# Altium project PMI_Action.PrjPcb
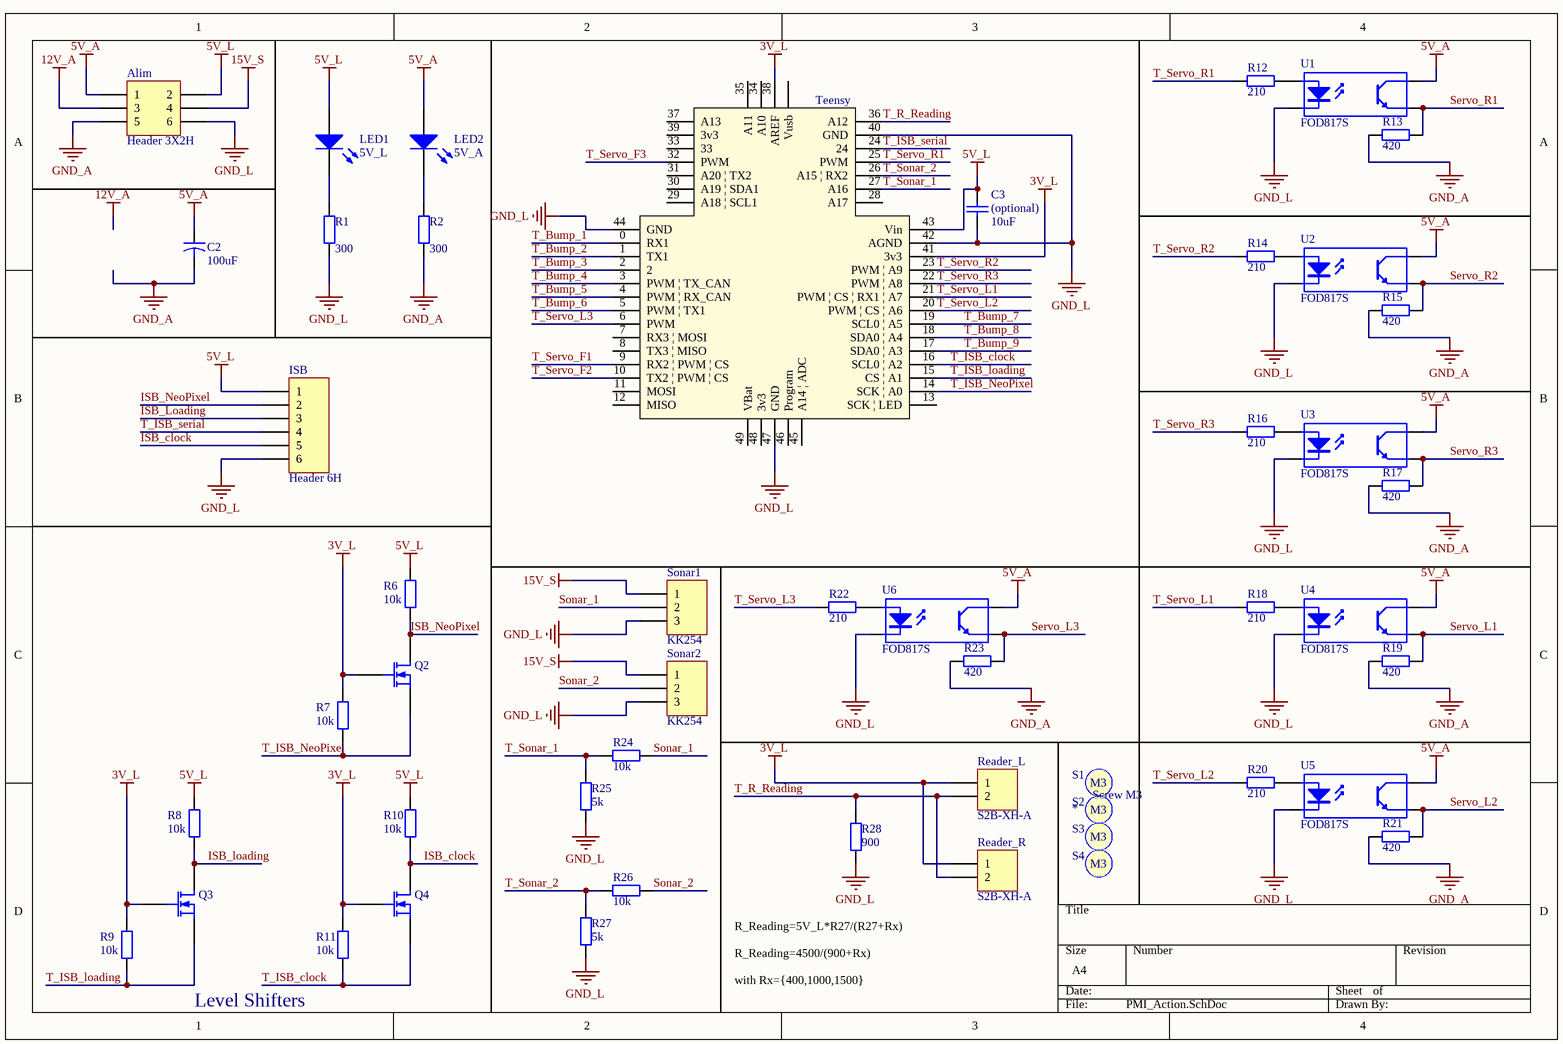
[diagram p0: PMI_Action.SchDoc]
2 sheets, 82 parts. Net scope: global (net labels, ports and power ports of the same name join across sheets).
Board files: PMI_Action.PcbDoc, PMI_ActionV2.PcbDoc
Sheets:
  PMI_Action.SchDoc
  PMI_Action_bumpers.SchDoc

## Sheet PMI_Action.SchDoc
size A4

### Parts
Alim  Header 3X2H  [MOLEX_MINIFITJR_3X2]
C2  value 100uF  [Capacitor]  (hidden comment: Cap2)
C3  (optional)  value 10uF  [Capacitor 1206]
ISB  Header 6H  [S6B-XH-A]
LED1  5V_L  [KP-3216SEC]
LED2  5V_A  [KP-3216SEC]
Q2  MOSFET-N  [SOT23_M]  (value not drawn)
Q3  MOSFET-N  [SOT23_M]  (value not drawn)
Q4  MOSFET-N  [SOT23_M]  (value not drawn)
R1  value 300  [Resistor 1206]  (hidden comment: Res2)
R2  value 300  [Resistor 1206]  (hidden comment: Res2)
R6  value 10k  [Resistor 1206]  (hidden comment: Res2)
R7  value 10k  [Resistor 1206]  (hidden comment: Res2)
R8  value 10k  [Resistor 1206]  (hidden comment: Res2)
R9  value 10k  [Resistor 1206]  (hidden comment: Res2)
R10  value 10k  [Resistor 1206]  (hidden comment: Res2)
R11  value 10k  [Resistor 1206]  (hidden comment: Res2)
R12  value 210  [Resistor 1206]  (hidden comment: Res2)
R13  value 420  [Resistor 1206]  (hidden comment: Res2)
R14  value 210  [Resistor 1206]  (hidden comment: Res2)
R15  value 420  [Resistor 1206]  (hidden comment: Res2)
R16  value 210  [Resistor 1206]  (hidden comment: Res2)
R17  value 420  [Resistor 1206]  (hidden comment: Res2)
R18  value 210  [Resistor 1206]  (hidden comment: Res2)
R19  value 420  [Resistor 1206]  (hidden comment: Res2)
R20  value 210  [Resistor 1206]  (hidden comment: Res2)
R21  value 420  [Resistor 1206]  (hidden comment: Res2)
R22  value 210  [Resistor 1206]  (hidden comment: Res2)
R23  value 420  [Resistor 1206]  (hidden comment: Res2)
R24  value 10k  [Resistor 1206]  (hidden comment: Res2)
R25  value 5k  [Resistor 1206]  (hidden comment: Res2)
R26  value 10k  [Resistor 1206]  (hidden comment: Res2)
R27  value 5k  [Resistor 1206]  (hidden comment: Res2)
R28  value 900  [Resistor 1206]  (hidden comment: Res2)
Reader_L  S2B-XH-A  [S2B-XH-A]
Reader_R  S2B-XH-A  [S2B-XH-A]
S1  Screw M3  [Screw M3]  (mechanical)
S2  Screw M3  [Screw M3]  (value not drawn)  (mechanical)
S3  Screw M3  [Screw M3]  (value not drawn)  (mechanical)
S4  Screw M3  [Screw M3]  (value not drawn)  (mechanical)
Sonar1  KK254  [MOLEX KK254 3X1H M]
Sonar2  KK254  [MOLEX KK254 3X1H M]
Teensy  Teensy 3.2  [Teensy_A_PMI]  (value not drawn)
U1  FOD817S  [SOP254P1016X385-4N]
U2  FOD817S  [SOP254P1016X385-4N]
U3  FOD817S  [SOP254P1016X385-4N]
U4  FOD817S  [SOP254P1016X385-4N]
U5  FOD817S  [SOP254P1016X385-4N]
U6  FOD817S  [SOP254P1016X385-4N]

### Nets
3V_L: Q2.2(G) Q3.2(G) Q4.2(G) R7.2 R9.2 R11.2 Reader_L.1 Reader_R.1 Teensy.38(AREF) Teensy.41(3v3)
5V_A: Alim.1 C2.1 LED2.1(A) U1.4(C) U2.4(C) U3.4(C) U4.4(C) U5.4(C) U6.4(C)
5V_L: Alim.2 C3.2 ISB.1 LED1.1(A) R6.2 R8.2 R10.2 Teensy.43(Vin)
12V_A: Alim.3
15V_S: Alim.4 Sonar1.1 Sonar2.1
GND_A: Alim.5 C2.2 R2.1 R13.2 R15.2 R17.2 R19.2 R21.2 R23.2
GND_L: Alim.6 C3.1 ISB.6 R1.1 R25.2 R27.2 R28.2 Sonar1.3 Sonar2.3 Teensy.40(GND) Teensy.42(AGND) Teensy.44(GND) Teensy.47(GND) U1.2(K) U2.2(K) U3.2(K) U4.2(K) U5.2(K) U6.2(K)
ISB_clock: ISB.5 Q4.1(D) R10.1
ISB_Loading: ISB.3 Q3.1(D) R8.1
ISB_NeoPixel: ISB.2 Q2.1(D) R6.1
Servo_L1: R19.1 U4.3(E)
Servo_L2: R21.1 U5.3(E)
Servo_L3: R23.1 U6.3(E)
Servo_R1: R13.1 U1.3(E)
Servo_R2: R15.1 U2.3(E)
Servo_R3: R17.1 U3.3(E)
Sonar_1: R24.1 Sonar1.2
Sonar_2: R26.1 Sonar2.2
T_Bump_1: Teensy.0(RX1)  [project net Bump_1]
T_Bump_2: Teensy.1(TX1)  [project net Bump_2]
T_Bump_3: Teensy.2  [project net Bump_3]
T_Bump_4: Teensy.3(PWM_|_TX_CAN)  [project net Bump_4]
T_Bump_5: Teensy.4(PWM_|_RX_CAN)  [project net Bump_5]
T_Bump_6: Teensy.5(PWM_|_TX1)  [project net Bump_6]
T_Bump_7: Teensy.19(SCL0_|_A5)  [project net Bump_7]
T_Bump_8: Teensy.18(SDA0_|_A4)  [project net Bump_8]
T_Bump_9: Teensy.17(SDA0_|_A3)  [project net Bump_9]
T_ISB_clock: Q4.3(S) R11.1 Teensy.16(SCL0_|_A2)
T_ISB_loading: Q3.3(S) R9.1 Teensy.15(CS_|_A1)
T_ISB_NeoPixel: Q2.3(S) R7.1 Teensy.14(SCK_|_A0)
T_ISB_serial: ISB.4 Teensy.24
T_R_Reading: R28.1 Reader_L.2 Reader_R.2 Teensy.36(A12)
T_Servo_F1: Teensy.9(RX2_|_PWM_|_CS)
T_Servo_F2: Teensy.10(TX2_|_PWM_|_CS)
T_Servo_F3: Teensy.32(PWM)
T_Servo_L1: R18.2 Teensy.21(PWM_|_CS_|_RX1_|_A7)
T_Servo_L2: R20.2 Teensy.20(PWM_|_CS_|_A6)
T_Servo_L3: R22.2 Teensy.6(PWM)
T_Servo_R1: R12.2 Teensy.25(PWM)
T_Servo_R2: R14.2 Teensy.23(PWM_|_A9)
T_Servo_R3: R16.2 Teensy.22(PWM_|_A8)
T_Sonar_1: R24.2 R25.1 Teensy.27(A16)
T_Sonar_2: R26.2 R27.1 Teensy.26(A15_|_RX2)
NetLED1_2: LED1.2(K) R1.2
NetLED2_2: LED2.2(K) R2.2
NetR12_1: R12.1 U1.1(A)
NetR14_1: R14.1 U2.1(A)
NetR16_1: R16.1 U3.1(A)
NetR18_1: R18.1 U4.1(A)
NetR20_1: R20.1 U5.1(A)
NetR22_1: R22.1 U6.1(A)

Not connected (* = marked no-connect by the designer): Teensy 7(RX3_|_MOSI) 8(TX3_|_MISO) 11(MOSI) 12(MISO) 13(SCK_|_LED) 28(A17) 29(A18_|_SCL1) 30(A19_|_SDA1) 31(A20_|_TX2) 33 34(A10) 35(A11) 37(A13) 39(3v3) 45(A14_|_ADC) 46(Program) 48(3v3) 49(VBat) 50(Vusb)

### Notes on the sheet
- (near Reader_R) R_Reading=5V_L*R27/(R27+Rx)
  R_Reading=4500/(900+Rx)
  with Rx={400,1000,1500}
- (near R11) Level Shifters
- (in symbol Screw M3) M3

### Library data of the parts
Alim = Header 3X2H: Header, 3-Pin, Dual row, Right Angle; LatestRevisionDate: 17-Jul-2002; LatestRevisionNote: Re-released for DXP Platform.; Publisher: Altium Limited
C2 = Cap2: Capacitor; Published: 23-Sep-2002; PackageReference: CAPR5-4X5; Publisher: Altium Limited; PackageDescription: Capacitor; 2 Leads
C3 = Cap: Capacitor; Published: 8-Jun-2000; LatestRevisionDate: 17-Jul-2002; LatestRevisionNote: Re-released for DXP Platform.; PackageReference: RAD-0.3; Publisher: Altium Limited; PackageDescription: Radial Cap, Thru-Hole; 2 Leads; 0.3 in Pin Spacing
ISB = Header 6H: Header, 6-Pin, Right Angle; LatestRevisionDate: 17-Jul-2002; LatestRevisionNote: Re-released for DXP Platform.; Publisher: Altium Limited
LED1 LED2 = LED2: Typical RED, GREEN, YELLOW, AMBER GaAs LED; Published: 8-Jun-2000; LatestRevisionDate: 17-Jul-2002; LatestRevisionNote: Re-released for DXP Platform.; PackageVersion: Feb-2002; PackageReference: 3.2X1.6X1.1; Publisher: Altium Limited; PackageDescription: SM LED; 2 Flat Leads
Q2-Q4 = MOSFET-N: N-Channel MOSFET; Published: 8-Jun-2000; LatestRevisionDate: 17-Jul-2002; LatestRevisionNote: Re-released for DXP Platform.; PackageVersion: 1995/1996; PackageReference: E3; Publisher: Altium Limited; PackageDescription: TO, Flat Index; 3 In-Line, Axial Leads; Body Dia. 4.6mm; Lead Dia. 0.5 mm (max)
R1 R2 R6-R28 = Res2: Resistor; Published: 8-Jun-2000; LatestRevisionDate: 17-Jul-2002; LatestRevisionNote: Re-released for DXP Platform.; PackageReference: AXIAL-0.4; Publisher: Altium Limited; PackageDescription: Axial Device, Thru-Hole; 2 Leads; 0.4 in Pin Spacing
Reader_L Reader_R = Header 2H: Header, 2-Pin, Right Angle; LatestRevisionDate: 17-Jul-2002; LatestRevisionNote: Re-released for DXP Platform.; Publisher: Altium Limited
Sonar1 Sonar2 = Header 3H: Header, 3-Pin, Right Angle; LatestRevisionDate: 17-Jul-2002; LatestRevisionNote: Re-released for DXP Platform.; Publisher: Altium Limited
Teensy = teensy3.2
U1-U6 = Optoisolator1: 4-Pin Phototransistor Optocoupler; Published: 24-Mar-1999; LatestRevisionDate: 04-Mar-2005; LatestRevisionNote: Sch pins 3 & 4 Swapped.; DatasheetVersion: Nov-2003; PackageReference: DIP-4; Publisher: Altium Limited

## Sheet PMI_Action_bumpers.SchDoc
size A4
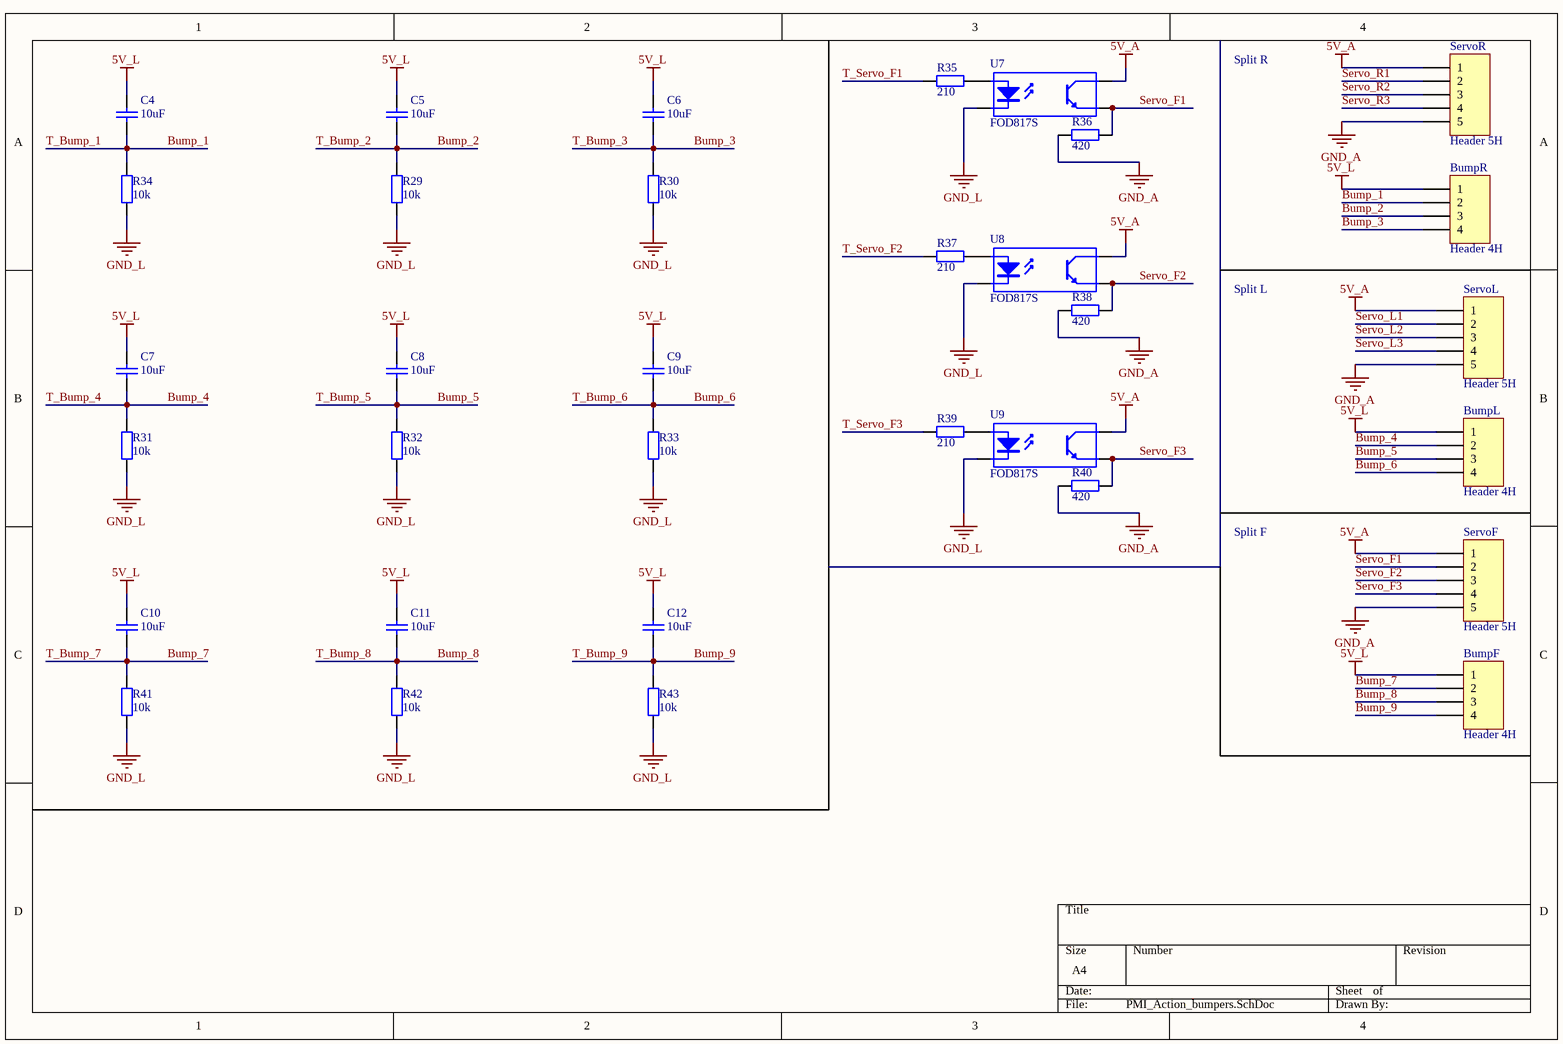
[diagram p1: PMI_Action_bumpers.SchDoc]

### Parts
BumpF  Header 4H  [S4B-XH-A]
BumpL  Header 4H  [S4B-XH-A]
BumpR  Header 4H  [S4B-XH-A]
C4  value 10uF  [Capacitor 1206]  (hidden comment: (optional))
C5  value 10uF  [Capacitor 1206]  (hidden comment: (optional))
C6  value 10uF  [Capacitor 1206]  (hidden comment: (optional))
C7  value 10uF  [Capacitor 1206]  (hidden comment: (optional))
C8  value 10uF  [Capacitor 1206]  (hidden comment: (optional))
C9  value 10uF  [Capacitor 1206]  (hidden comment: (optional))
C10  value 10uF  [Capacitor 1206]  (hidden comment: (optional))
C11  value 10uF  [Capacitor 1206]  (hidden comment: (optional))
C12  value 10uF  [Capacitor 1206]  (hidden comment: (optional))
R29  value 10k  [Resistor 1206]  (hidden comment: Res2)
R30  value 10k  [Resistor 1206]  (hidden comment: Res2)
R31  value 10k  [Resistor 1206]  (hidden comment: Res2)
R32  value 10k  [Resistor 1206]  (hidden comment: Res2)
R33  value 10k  [Resistor 1206]  (hidden comment: Res2)
R34  value 10k  [Resistor 1206]  (hidden comment: Res2)
R35  value 210  [Resistor 1206]  (hidden comment: Res2)
R36  value 420  [Resistor 1206]  (hidden comment: Res2)
R37  value 210  [Resistor 1206]  (hidden comment: Res2)
R38  value 420  [Resistor 1206]  (hidden comment: Res2)
R39  value 210  [Resistor 1206]  (hidden comment: Res2)
R40  value 420  [Resistor 1206]  (hidden comment: Res2)
R41  value 10k  [Resistor 1206]  (hidden comment: Res2)
R42  value 10k  [Resistor 1206]  (hidden comment: Res2)
R43  value 10k  [Resistor 1206]  (hidden comment: Res2)
ServoF  Header 5H  [S5B-XH-A]
ServoL  Header 5H  [S5B-XH-A]
ServoR  Header 5H  [S5B-XH-A]
U7  FOD817S  [SOP254P1016X385-4N]
U8  FOD817S  [SOP254P1016X385-4N]
U9  FOD817S  [SOP254P1016X385-4N]

### Nets
5V_A: ServoF.1 ServoL.1 ServoR.1 U7.4(C) U8.4(C) U9.4(C)
5V_L: BumpF.1 BumpL.1 BumpR.1 C4.2 C5.2 C6.2 C7.2 C8.2 C9.2 C10.2 C11.2 C12.2
GND_A: R36.2 R38.2 R40.2 ServoF.5 ServoL.5 ServoR.5
GND_L: R29.2 R30.2 R31.2 R32.2 R33.2 R34.2 R41.2 R42.2 R43.2 U7.2(K) U8.2(K) U9.2(K)
Bump_1: BumpR.2 C4.1 R34.1  [also labelled T_Bump_1]
Bump_2: BumpR.3 C5.1 R29.1  [also labelled T_Bump_2]
Bump_3: BumpR.4 C6.1 R30.1  [also labelled T_Bump_3]
Bump_4: BumpL.2 C7.1 R31.1  [also labelled T_Bump_4]
Bump_5: BumpL.3 C8.1 R32.1  [also labelled T_Bump_5]
Bump_6: BumpL.4 C9.1 R33.1  [also labelled T_Bump_6]
Bump_7: BumpF.2 C10.1 R41.1  [also labelled T_Bump_7]
Bump_8: BumpF.3 C11.1 R42.1  [also labelled T_Bump_8]
Bump_9: BumpF.4 C12.1 R43.1  [also labelled T_Bump_9]
Servo_F1: R36.1 ServoF.2 U7.3(E)
Servo_F2: R38.1 ServoF.3 U8.3(E)
Servo_F3: R40.1 ServoF.4 U9.3(E)
Servo_L1: ServoL.2
Servo_L2: ServoL.3
Servo_L3: ServoL.4
Servo_R1: ServoR.2
Servo_R2: ServoR.3
Servo_R3: ServoR.4
T_Servo_F1: R35.2
T_Servo_F2: R37.2
T_Servo_F3: R39.2
NetR35_1: R35.1 U7.1(A)
NetR37_1: R37.1 U8.1(A)
NetR39_1: R39.1 U9.1(A)

### Notes on the sheet
- Split R
- Split L
- Split F

### Library data of the parts
BumpF BumpL BumpR = Header 4H: Header, 4-Pin, Right Angle; LatestRevisionDate: 17-Jul-2002; LatestRevisionNote: Re-released for DXP Platform.; Publisher: Altium Limited
C4-C12 = Cap: Capacitor; Published: 8-Jun-2000; LatestRevisionDate: 17-Jul-2002; LatestRevisionNote: Re-released for DXP Platform.; PackageReference: RAD-0.3; Publisher: Altium Limited; PackageDescription: Radial Cap, Thru-Hole; 2 Leads; 0.3 in Pin Spacing
R29-R43 = Res2: Resistor; Published: 8-Jun-2000; LatestRevisionDate: 17-Jul-2002; LatestRevisionNote: Re-released for DXP Platform.; PackageReference: AXIAL-0.4; Publisher: Altium Limited; PackageDescription: Axial Device, Thru-Hole; 2 Leads; 0.4 in Pin Spacing
ServoF ServoL ServoR = Header 5H: Header, 5-Pin, Right Angle; LatestRevisionDate: 17-Jul-2002; LatestRevisionNote: Re-released for DXP Platform.; Publisher: Altium Limited
U7-U9 = Optoisolator1: 4-Pin Phototransistor Optocoupler; Published: 24-Mar-1999; LatestRevisionDate: 04-Mar-2005; LatestRevisionNote: Sch pins 3 & 4 Swapped.; DatasheetVersion: Nov-2003; PackageReference: DIP-4; Publisher: Altium Limited

## Nets that join several sheets
5V_A: PMI_Action (9 pins), PMI_Action_bumpers (6 pins)
5V_L: PMI_Action (8 pins), PMI_Action_bumpers (12 pins)
GND_A: PMI_Action (9 pins), PMI_Action_bumpers (6 pins)
GND_L: PMI_Action (19 pins), PMI_Action_bumpers (12 pins)
Bump_1: PMI_Action (Teensy.0), PMI_Action_bumpers (BumpR.2 C4.1 R34.1)
Bump_2: PMI_Action (Teensy.1), PMI_Action_bumpers (BumpR.3 C5.1 R29.1)
Bump_3: PMI_Action (Teensy.2), PMI_Action_bumpers (BumpR.4 C6.1 R30.1)
Bump_4: PMI_Action (Teensy.3), PMI_Action_bumpers (BumpL.2 C7.1 R31.1)
Bump_5: PMI_Action (Teensy.4), PMI_Action_bumpers (BumpL.3 C8.1 R32.1)
Bump_6: PMI_Action (Teensy.5), PMI_Action_bumpers (BumpL.4 C9.1 R33.1)
Bump_7: PMI_Action (Teensy.19), PMI_Action_bumpers (BumpF.2 C10.1 R41.1)
Bump_8: PMI_Action (Teensy.18), PMI_Action_bumpers (BumpF.3 C11.1 R42.1)
Bump_9: PMI_Action (Teensy.17), PMI_Action_bumpers (BumpF.4 C12.1 R43.1)
Servo_L1: PMI_Action (R19.1 U4.3), PMI_Action_bumpers (ServoL.2)
Servo_L2: PMI_Action (R21.1 U5.3), PMI_Action_bumpers (ServoL.3)
Servo_L3: PMI_Action (R23.1 U6.3), PMI_Action_bumpers (ServoL.4)
Servo_R1: PMI_Action (R13.1 U1.3), PMI_Action_bumpers (ServoR.2)
Servo_R2: PMI_Action (R15.1 U2.3), PMI_Action_bumpers (ServoR.3)
Servo_R3: PMI_Action (R17.1 U3.3), PMI_Action_bumpers (ServoR.4)
T_Servo_F1: PMI_Action (Teensy.9), PMI_Action_bumpers (R35.2)
T_Servo_F2: PMI_Action (Teensy.10), PMI_Action_bumpers (R37.2)
T_Servo_F3: PMI_Action (Teensy.32), PMI_Action_bumpers (R39.2)